# EAGLE design MUX (EAGLE 9.0.0)
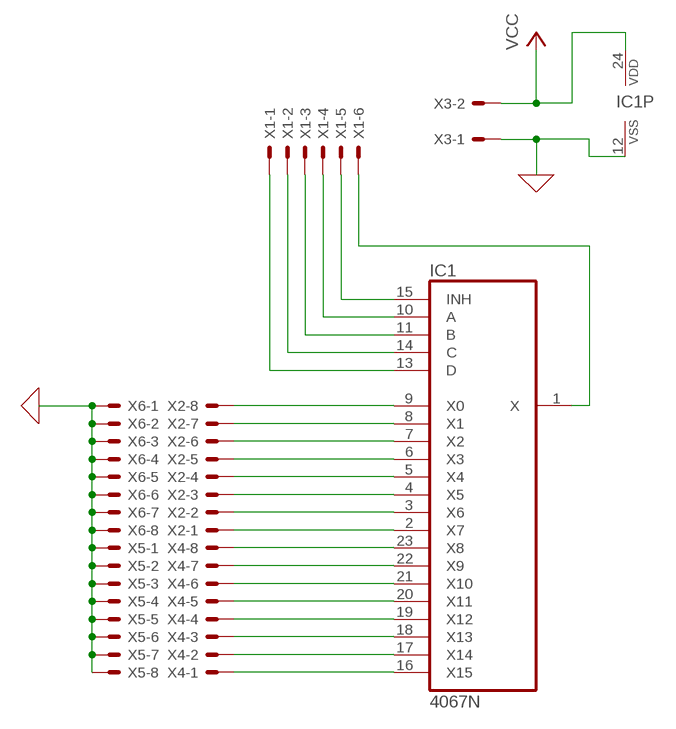
[diagram p0: schematic, sheet 1]

## Parts
IC1  4067N  [DIL24-6]
X1  KK-156-6  [KK-156-6]
X2  KK-156-8  [KK-156-8]
X3  KK-156-2  [KK-156-2]
X4  KK-156-8  [KK-156-8]
X5  KK-156-8  [KK-156-8]
X6  KK-156-8  [KK-156-8]

## Nets
0: IC1.12(VSS) X3.1 X5.1 X5.2 X5.3 X5.4 X5.5 X5.6 X5.7 X5.8 X6.1 X6.2 X6.3 X6.4 X6.5 X6.6 X6.7 X6.8 ; supply symbol labelled GND
N$1: IC1.9(X0) X2.8
N$2: IC1.8(X1) X2.7
N$3: IC1.7(X2) X2.6
N$4: IC1.6(X3) X2.5
N$5: IC1.5(X4) X2.4
N$6: IC1.4(X5) X2.3
N$7: IC1.3(X6) X2.2
N$8: IC1.2(X7) X2.1
N$9: IC1.23(X8) X4.8
N$10: IC1.22(X9) X4.7
N$11: IC1.21(X10) X4.6
N$12: IC1.20(X11) X4.5
N$13: IC1.19(X12) X4.4
N$14: IC1.18(X13) X4.3
N$15: IC1.17(X14) X4.2
N$16: IC1.16(X15) X4.1
N$17: IC1.13(D) X1.1
N$18: IC1.14(C) X1.2
N$19: IC1.11(B) X1.3
N$20: IC1.10(A) X1.4
N$21: IC1.15(INH) X1.5
N$22: IC1.1(X) X1.6
VCC: IC1.24(VDD) X3.2

## Library data of the parts
IC1 = 40xx:4067: 16-channel ANALOG MULTIPLEXER
X1 = con-molex:KK-156-6: KK 156 HEADER Source: http://www.molex.com/pdm_docs/sd/026604100_sd.pdf; MF: MOLEX; OC_FARNELL: unknown; OC_NEWARK: unknown
X2 X4-X6 = con-molex:KK-156-8: KK 156 HEADER Source: http://www.molex.com/pdm_docs/sd/026604100_sd.pdf; MF: MOLEX; OC_FARNELL: unknown; OC_NEWARK: unknown
X3 = con-molex:KK-156-2: KK 156 HEADER Source: http://www.molex.com/pdm_docs/sd/026604100_sd.pdf; MF: MOLEX; OC_FARNELL: unknown; OC_NEWARK: unknown

## Board
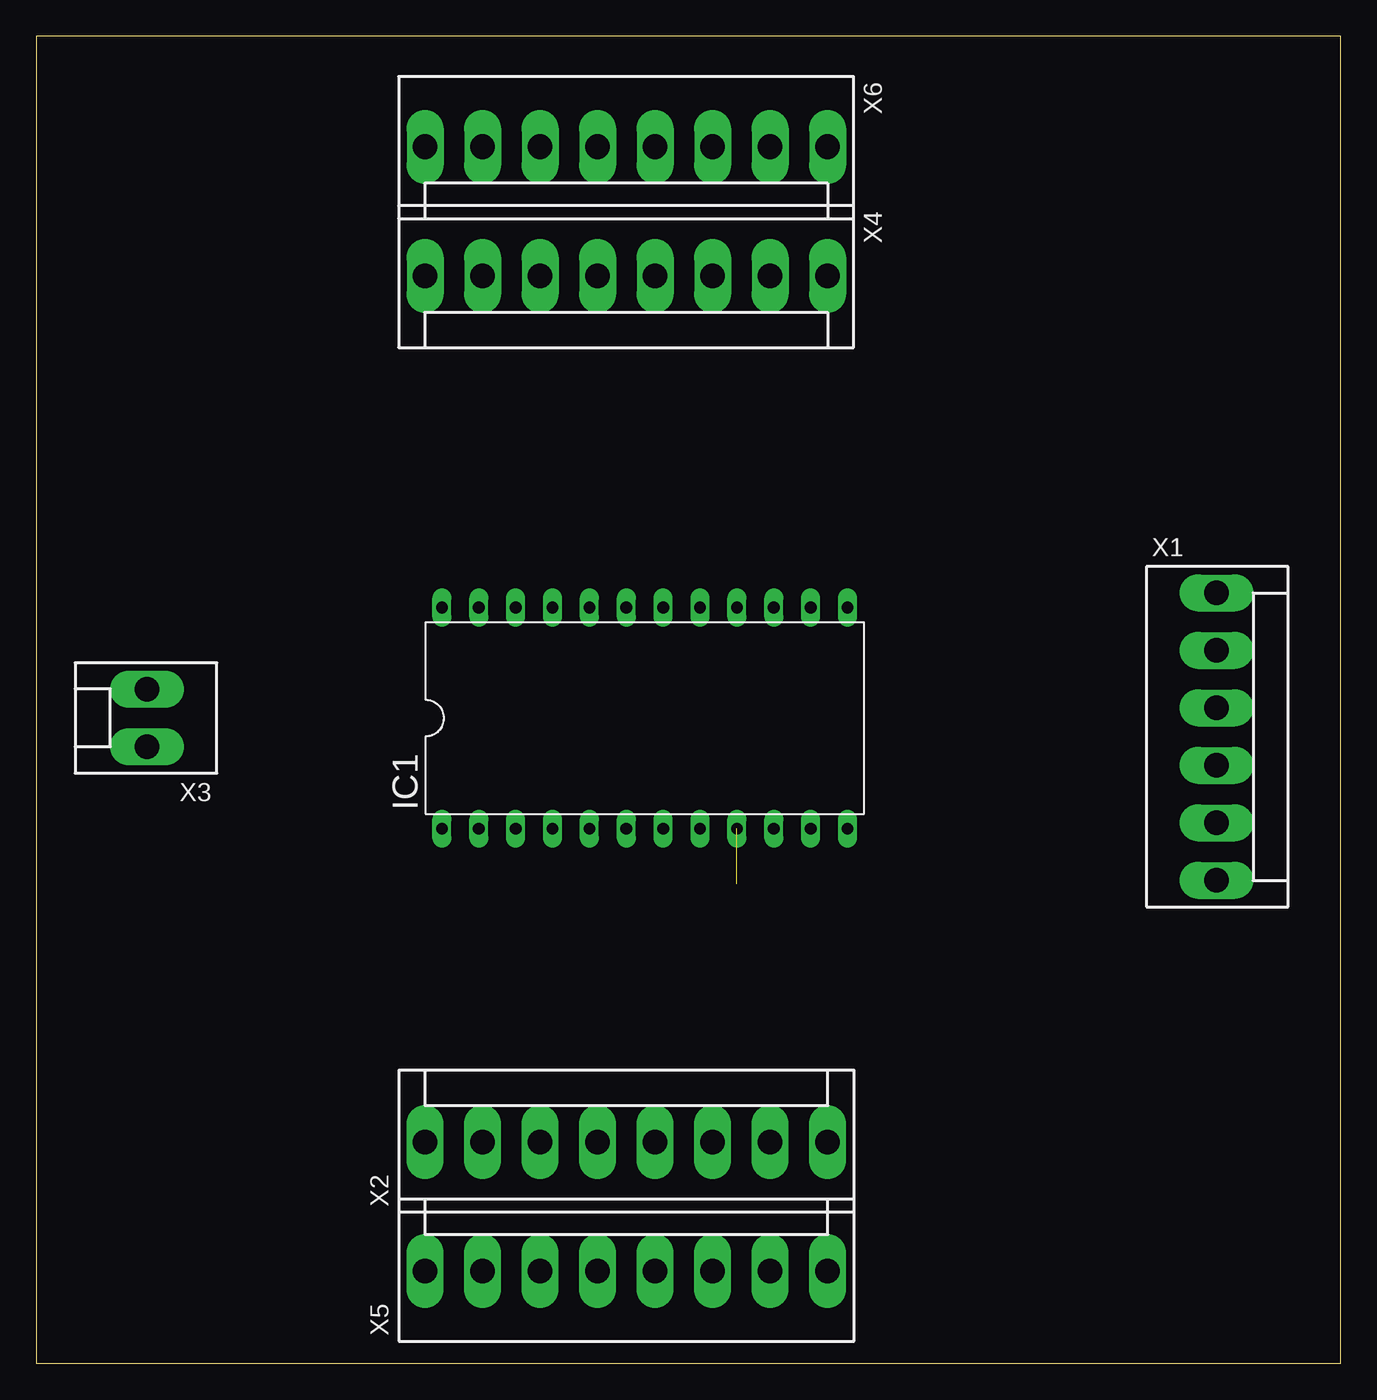
[diagram p1: board, top side]
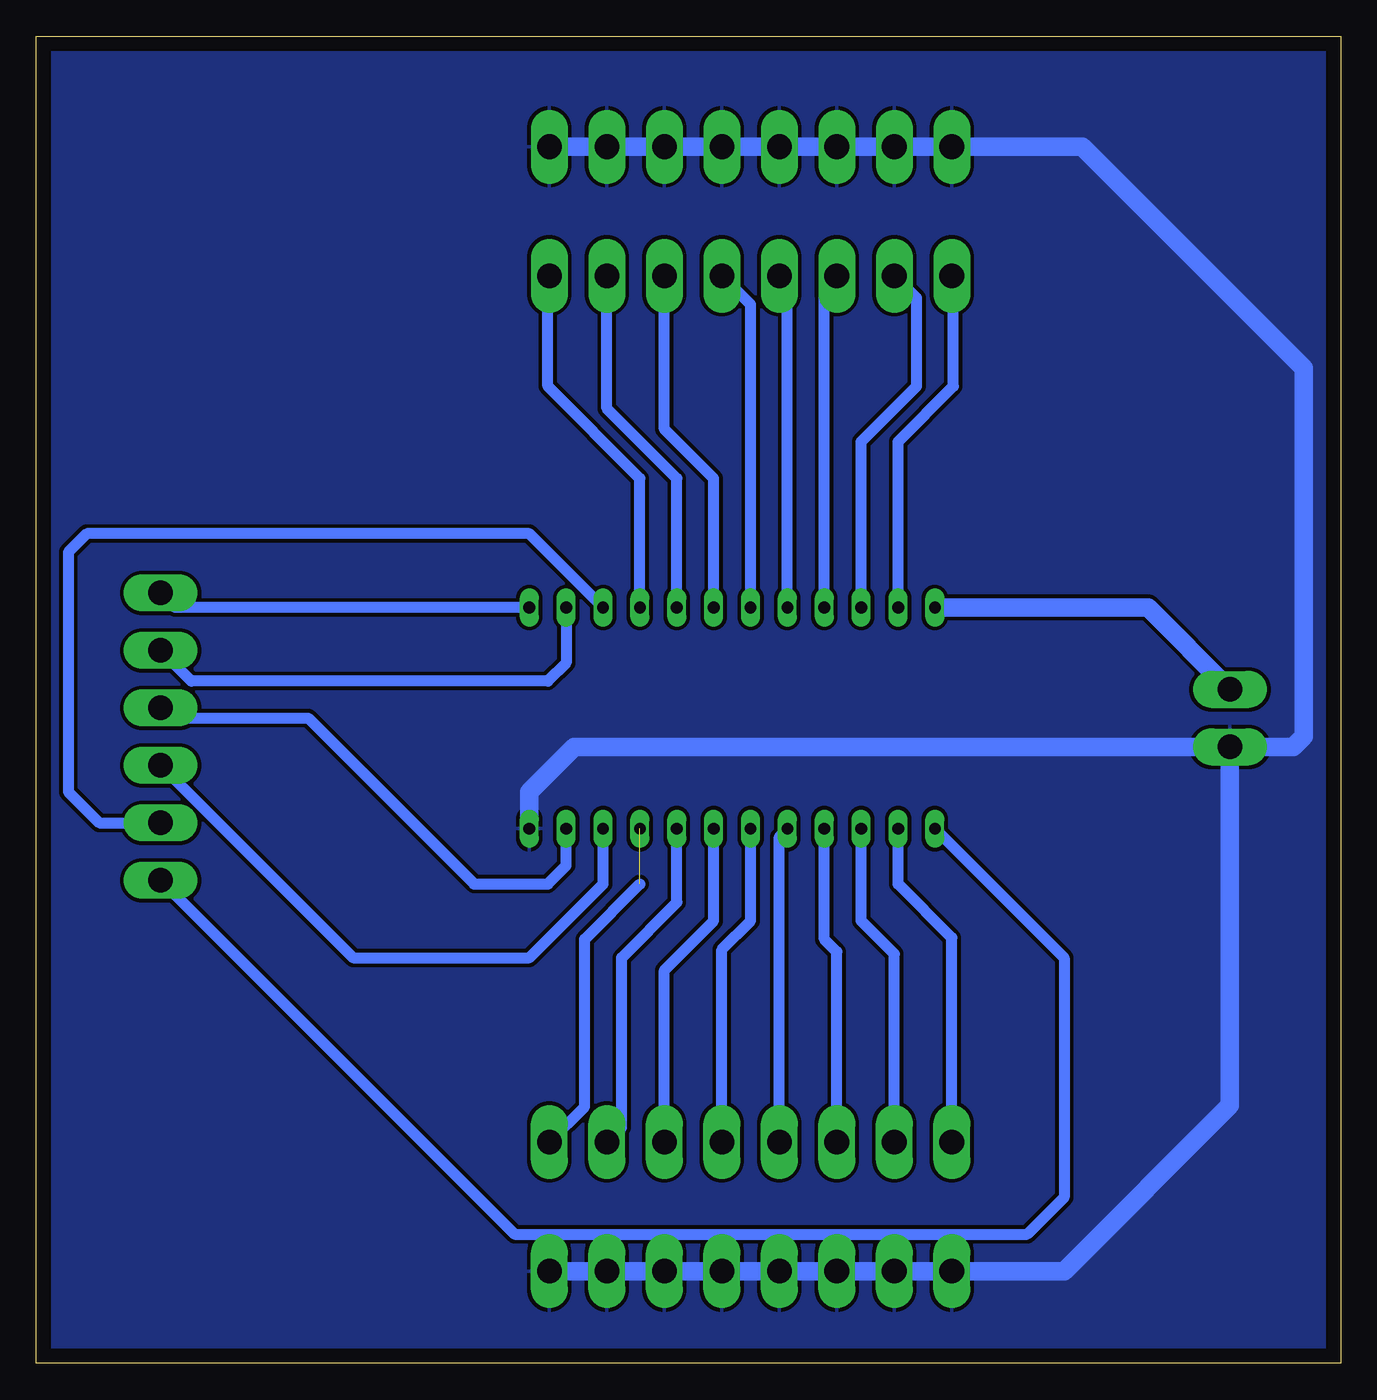
[diagram p2: board, bottom side, seen from below]

Size 89.84 x 91.43 mm. Coordinates in mm from the lower left corner, seen from the top.
Outline: 0,0 89.84,0 89.84,91.43 0,91.43 0,0
Copper layers (1*16): Top 0.035mm / dielectric 1.5mm / Bottom 0.035mm
Design rules "default": minimum track width 6mil, minimum drill 0.35mm, track to track 6mil, track to pad 6mil, pad to pad 6mil, via to via 6mil, smd to smd 6mil, copper to edge 40mil, drill to drill 6mil, minimum pad ring 10mil, minimum via ring 8mil, stop-mask expansion 4mil, vias tented up to drill 0mil, thermal gap 10mil

### Footprints (pad centres in the part's own frame; a part is rotated, then mirrored left to right if it is on the bottom)
DIL24-6 = drill 0.813 long: 1 -13.97,-7.62; 2 -11.43,-7.62; 3 -8.89,-7.62; 4 -6.35,-7.62; 5 -3.81,-7.62; 6 -1.27,-7.62; 7 1.27,-7.62; 8 3.81,-7.62; 9 6.35,-7.62; 10 8.89,-7.62; 11 11.43,-7.62; 12 13.97,-7.62; 13 13.97,7.62; 14 11.43,7.62; 15 8.89,7.62; 16 6.35,7.62; 17 3.81,7.62; 18 1.27,7.62; 19 -1.27,7.62; 20 -3.81,7.62; 21 -6.35,7.62; 22 -8.89,7.62; 23 -11.43,7.62; 24 -13.97,7.62
KK-156-6 = drill 1.7 pad 2.184 long: 1 -9.9,0; 2 -5.94,0; 3 -1.98,0; 4 1.98,0; 5 5.94,0; 6 9.9,0
KK-156-8 = drill 1.7 pad 2.184 long: 1 -13.86,0; 2 -9.9,0; 3 -5.94,0; 4 -1.98,0; 5 1.98,0; 6 5.94,0; 7 9.9,0; 8 13.86,0
KK-156-2 = drill 1.7 pad 2.184 long: 1 -1.98,0; 2 1.98,0

### Placement (x,y rotation side)
IC1  41.91,44.45 0 top
X1  81.28,43.18 270 top
X2  40.64,15.24 0 top
X3  7.62,44.45 90 top
X4  40.64,74.93 180 top
X5  40.64,6.35 0 top
X6  40.64,83.82 180 top

### Tracks (layer width: path | path; a pad name or v marks a point on that pad's centre or on a via)
0
  Bottom 1.27: X3.1 52.78,42.47 55.88,39.37 IC1.12 | X3.1 7.62,17.78 19.05,6.35 X5.1 X5.8 | X3.1 3.25,42.47 2.54,43.18 2.54,68.58 17.78,83.82 X6.1
  pour Bottom (isolate 0.254): 0,91.44 0,0 90.17,0 90.17,91.44
N$1  (1 unrouted)
  Bottom 0.762: X2.8 52.07,17.67 52.07,27.94 52.07,29.21 48.26,33.02
N$2
  Bottom 0.762: X2.7 49.53,16.25 49.53,27.94 45.72,31.75 IC1.8
N$3
  Bottom 0.762: X2.6 46.58,27.08 43.18,30.48 IC1.7
N$4
  Bottom 0.762: X2.5 42.62,28.5 40.64,30.48 IC1.6
N$5
  Bottom 0.762: X2.4 38.66,36.27 IC1.5
N$6
  Bottom 0.762: X2.3 34.7,28.35 35.56,29.21 IC1.4
N$7
  Bottom 0.762: X2.2 30.74,28.2 33.02,30.48 IC1.3
N$8
  Bottom 0.762: X2.1 26.78,29.32 30.48,33.02 IC1.2
N$9
  Bottom 0.762: IC1.23 30.48,63.5 26.67,67.31 26.67,74.82 X4.8
N$10
  Bottom 0.762: IC1.22 33.02,63.5 29.21,67.31 29.21,73.4 X4.7
N$11
  Bottom 0.762: IC1.21 35.56,74.07 X4.6
N$12
  Bottom 0.762: IC1.20 38.1,74.37 X4.5
N$13
  Bottom 0.762: IC1.19 40.64,72.95 X4.4
N$14
  Bottom 0.762: IC1.18 43.18,60.96 46.58,64.36 X4.3
N$15
  Bottom 0.762: IC1.17 45.72,60.96 50.54,65.78 X4.2
N$16
  Bottom 0.762: X4.1 54.61,74.82 54.61,67.31 48.26,60.96 IC1.16
N$17
  Bottom 0.762: IC1.13 80.27,52.07 X1.1
N$18
  Bottom 0.762: IC1.14 53.34,48.26 54.61,46.99 79.15,46.99 X1.2
N$19
  Bottom 0.762: X1.3 80.57,44.45 71.12,44.45 59.69,33.02 54.61,33.02 53.34,34.29 IC1.11
N$20
  Bottom 0.762: X1.4 68.02,27.94 55.88,27.94 50.8,33.02 IC1.10
N$21
  Bottom 0.762: IC1.15 55.88,57.15 86.36,57.15 87.63,55.88 87.63,39.37 85.5,37.24 X1.5
N$22
  Bottom 0.762: X1.6 56.89,8.89 21.59,8.89 19.05,11.43 19.05,27.94 IC1.1
VCC
  Bottom 1.27: X3.2 13.26,52.07 IC1.24